# Altium schematic sheet Temperature and Huminity Sensor.SchDoc
size A4; SheetNumber: 3; SheetTotal: 9
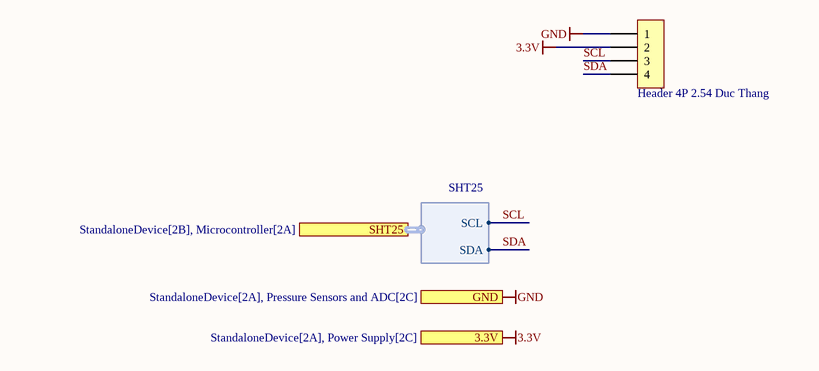
[diagram p0: Temperature and Huminity Sensor.SchDoc]

## Parts
SHT25  Header 4P 2.54 Duc Thang  [XH2.54M-4]

## Ports
3.3V (see StandaloneDevice[2A], Power Supply[2C]), GND (see StandaloneDevice[2A], Pressure Sensors and ADC[2C]), SHT25 (harness SHT25, see StandaloneDevice[2B], Microcontroller[2A])

## Harnesses
SHT25: SCL, SDA

## Nets
3.3V: SHT25.2 ; port 3.3V
GND: SHT25.1 ; port GND
SCL: SHT25.3 ; port SHT25.SCL
SDA: SHT25.4 ; port SHT25.SDA

## Library data of the parts
SHT25 = Header 4P 2.54 Duc Thang: Cắm; Ten_Linh_Kien: Header 4P XH2.54-4P Đực Thẳng; Don_Vi: Con; Ma_Hang: MH001285; Chung_Loai: Cắm